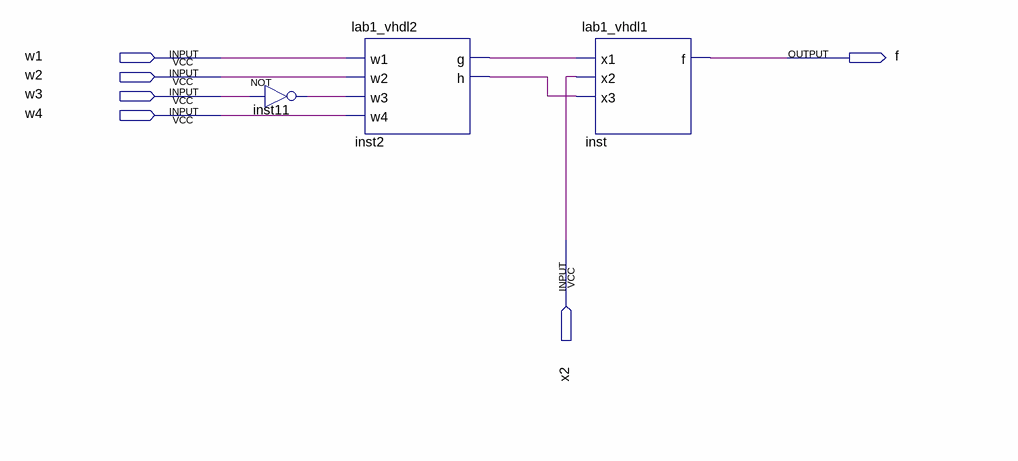
[diagram p0: schematic sheet]
// Quartus schematic mixeddesign.bdf as structural Verilog: 3 symbols, 6 pins
module mixeddesign (
  input  w1,
  input  w2,
  input  w3,
  input  w4,
  input  x2,
  output f
);

  wire inst2_g, inst2_h, inst11_out;

  not inst11 (inst11_out, w3);
  lab1_vhdl2 inst2 (.w1(w1), .w2(w2), .w3(inst11_out), .w4(w4), .g(inst2_g), .h(inst2_h));
  lab1_vhdl1 inst (.x1(inst2_g), .x2(x2), .x3(inst2_h), .f(f));
endmodule
